# Altium project T-LOG v1.0.PrjPcb
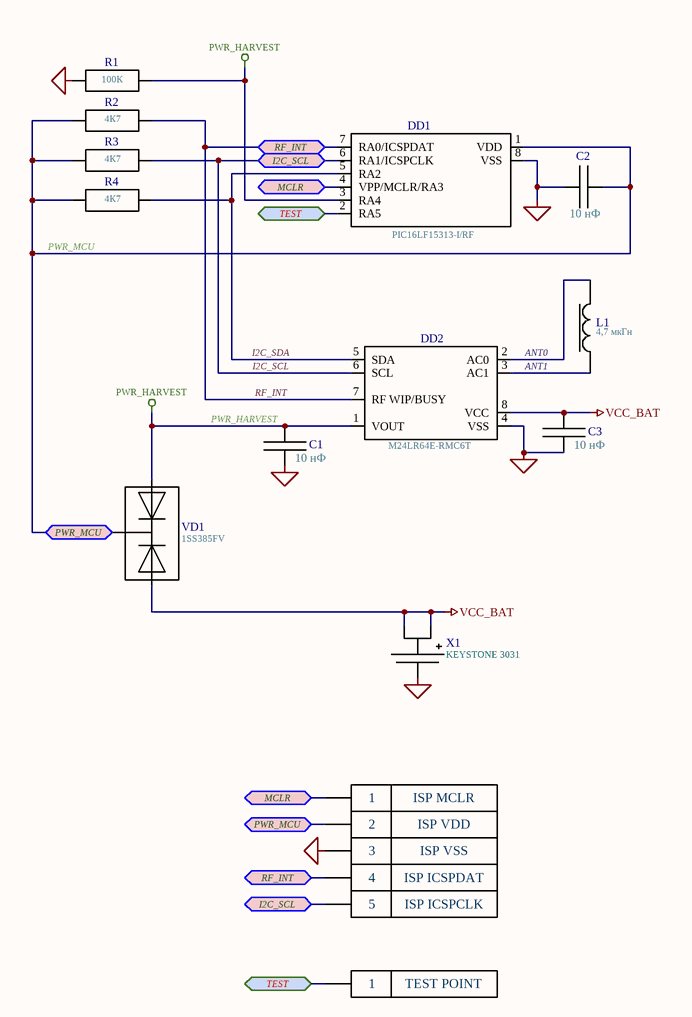
[diagram p0: T-LOG v1.0.SchDoc]
1 sheet, 18 parts. Net scope: flat (ports and power ports of the same name join across sheets).
Board file: T-LOG v1.0.PcbDoc

## Sheet T-LOG v1.0.SchDoc
size 209 x 297 mm

### Parts
C1  10 нФ  [C0402]
C2  10 нФ  [C0402]
C3  10 нФ  [C0402]
DD1  PIC16LF15313-I/RF  [UDFN_3x3x0.5]
DD2  M24LR64E-RMC6T  [UDFN-8_2X3]
K1  PIC ISP  [THRU_HOLE_02x045]  (value not drawn)  (no BOM)
K2  PIC ISP  [THRU_HOLE_02x045]  (value not drawn)  (no BOM)
K3  PIC ISP  [THRU_HOLE_02x045]  (value not drawn)  (no BOM)
K4  PIC ISP  [THRU_HOLE_02x045]  (value not drawn)  (no BOM)
K5  PIC ISP  [THRU_HOLE_02x045]  (value not drawn)  (no BOM)
K6  PIC ISP  [THRU_HOLE_02x045]  (value not drawn)  (no BOM)
L1  4,7 мкГн  [WE-LQ_1210]
R1  100К  [R0402]
R2  4К7  [R0402]
R3  4К7  [R0402]
R4  4К7  [R0402]
VD1  1SS385FV  [SOT-723]
X1  KEYSTONE 3031  [KEYSTONE_3031]

### Ports
I2C_SCL (bidir), MCLR (bidir), PWR_MCU (bidir), RF_INT (bidir), TEST (bidir)

### Nets
GND: C1.1 C2.2 C3.1 DD1.8(VSS) DD2.4(VSS) K3.1 R1.1 X1.3
PWR_HARVEST: C1.2 DD1.3(RA4) DD2.1(VOUT) R1.2 VD1.2
VCC_BAT: C3.2 DD2.8(VCC) VD1.1 X1.1 X1.2
ANT0: DD2.2(AC0) L1.2
ANT1: DD2.3(AC1) L1.1
I2C_SCL: DD1.6(RA1/ICSPCLK) DD2.6(SCL) K5.1 R3.2 ; port I2C_SCL
I2C_SDA: DD1.5(RA2) DD2.5(SDA) R4.2
MCLR: DD1.4(VPP/MCLR/RA3) K1.1 ; port MCLR
PWR_MCU: C2.1 DD1.1(VDD) K2.1 R2.1 R3.1 R4.1 VD1.3 ; port PWR_MCU
RF_INT: DD1.7(RA0/ICSPDAT) DD2.7(RF_WIP/BUSY) K4.1 R2.2 ; port RF_INT
TEST: DD1.2(RA5) K6.1 ; port TEST

### Notes on the sheet
- 1
- 2
- 3
- ISP MCLR
- ISP VDD
- ISP VSS
- 4
- 5
- ISP ICSPDAT
- ISP ICSPCLK
- (near K6) 1
- TEST POINT
- Перв. Примен.
- Справ. №
- Н.контр.
- Подп и дата
- Инв.№ дубл.
- Взам. инв.№
- Изм.
- Лист
- № докум.
- Подп.
- Дата
- Лит.
- Масса.
- Масштаб
- Пров.
- Т.Контр.
- Разраб.
- Схема электрическая
- принципиальная
- Листов
- б/м
- Инв.№подп.
- Н.Контр.
- Утв.
- Копировал:
- Формат А4

### Library data of the parts
C1-C3 = C0402: Чип-конденсатор 0,01 мкФ 50 В 0402; TYPE: Чип-конденсатор 0402
DD1 = PIC16LF15313-I/RF: Микроконтроллер PIC16LF15313-I/RF
DD2 = M24LR64E-RMC6T: Память EEPROM I2C/NFC 64Кбит M24LR64E-RMC6T UFDFN8 ST
K1-K6 = THRU_HOLE_02x045: used for PIC16 ISP in T-LOG project
L1 = WE-LQ_744032004: Чип-индуктивность WE-LQ 744032004 4,7 мкГн 0,49 А Wurth Elektronik; TYPE: LQM2HPN2R2MJ0
R1 = R0402: Чип-резистор 100 кОм 5% 0402; TYPE: Чип-резистор 0402
R2-R4 = R0402: Чип-резистор 4,7 кОм 5% 0402; TYPE: Чип-резистор 0402
VD1 = 1SS385FV: Диодная сборка с общим катодом 1SS385FV SOT-723 Toshiba
X1 = KEYSTONE_3031: Держатель элемента CR1025 KEYSTONE 3031